# Altium schematic sheet Current Measurement.SchDoc
size A4
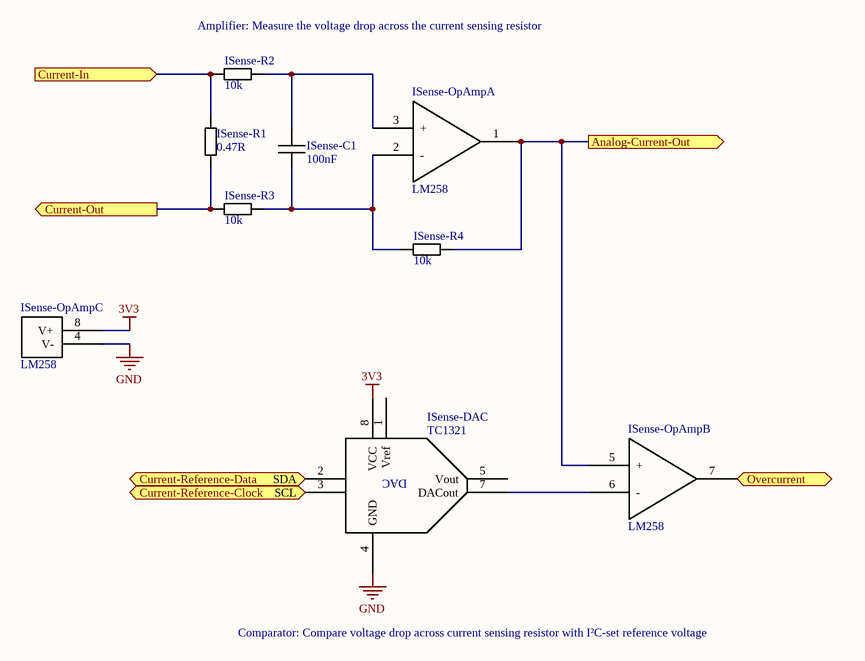
[diagram p0: Current Measurement.SchDoc]

## Parts
ISense-C1  100nF  [C 0805 / 2012]
ISense-DAC  TC1321  [SOIC-8]
ISense-OpAmp  LM258  [SOIC-8]  (parts A,B,C of 3)
ISense-R1  0.47R  [R 0805 / 2012]
ISense-R2  10k  [R 0805 / 2012]
ISense-R3  10k  [R 0805 / 2012]
ISense-R4  10k  [R 0805 / 2012]

## Ports
Analog-Current-Out (out), Current-In (in), Current-Out (out), Current-Reference-Clock (in), Current-Reference-Data (in), Overcurrent (out)

## Nets
3V3: ISense-DAC.8(VCC) ISense-OpAmp.8(V+)
GND: ISense-DAC.4(GND) ISense-OpAmp.4(V-)
Analog-Current-Out: ISense-OpAmp.1(OUT) ISense-OpAmp.5(+) ISense-R4.2 ; port Analog-Current-Out
Current-In: ISense-R1.2 ISense-R2.1 ; port Current-In
Current-Out: ISense-R1.1 ISense-R3.1 ; port Current-Out
Overcurrent: ISense-OpAmp.7(OUT) ; port Overcurrent
NetISense-C1_1: ISense-C1.1 ISense-OpAmp.3(+) ISense-R2.2
NetISense-C1_2: ISense-C1.2 ISense-OpAmp.2(-) ISense-R3.2 ISense-R4.1
NetISense-DAC_7: ISense-DAC.7(DACout) ISense-OpAmp.6(-)

Not connected (* = marked no-connect by the designer): ISense-DAC 1(Vref) 2(SDA) 3(SCL) 5(Vout)

## Notes on the sheet
- (near ISense-R2) Amplifier: Measure the voltage drop across the current sensing resistor
- Comparator: Compare voltage drop across current sensing resistor with I²C-set reference voltage
- (in symbol TC1321) DAC

## Library data of the parts
ISense-C1 = Capacitor
ISense-DAC = TC1321: DAC 10-Bit Two-Wire
ISense-OpAmp = LM258: Dual OpAmp
ISense-R1-ISense-R4 = Resistor